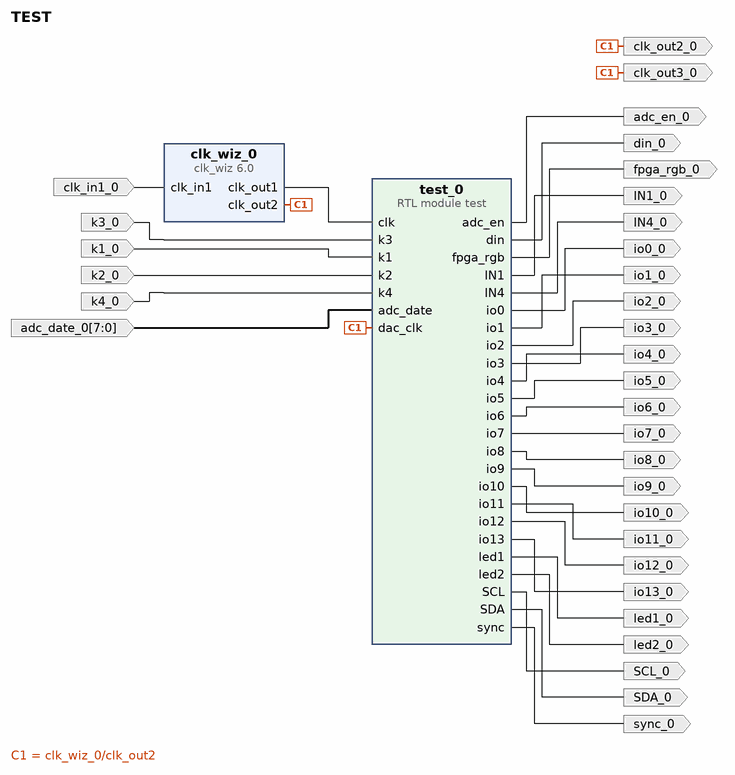
[diagram p0: block diagram of the top level]
# Vivado block design TEST, xc7s15ftgb196-1, Vivado 2018.2
create_bd_design TEST

create_bd_port -dir I k3_0
create_bd_port -dir I k1_0
create_bd_port -dir I k2_0
create_bd_port -dir I k4_0
create_bd_port -dir O io1_0
create_bd_port -dir O io2_0
create_bd_port -dir O io0_0
create_bd_port -dir O io3_0
create_bd_port -dir O io6_0
create_bd_port -dir O io4_0
create_bd_port -dir O io5_0
create_bd_port -dir O io7_0
create_bd_port -dir O io10_0
create_bd_port -dir O io8_0
create_bd_port -dir O io9_0
create_bd_port -dir O io11_0
create_bd_port -dir O led1_0
create_bd_port -dir O io12_0
create_bd_port -dir O io13_0
create_bd_port -dir O led2_0
create_bd_port -dir O fpga_rgb_0
create_bd_port -dir I -type clk clk_in1_0
create_bd_port -dir O -type clk clk_out2_0
set_property -dict {CONFIG.FREQ_HZ 20000000} [get_bd_ports clk_out2_0]
create_bd_port -dir O -type clk clk_out3_0
set_property -dict {CONFIG.FREQ_HZ 20000000} [get_bd_ports clk_out3_0]
create_bd_port -dir I -from 7 -to 0 adc_date_0
create_bd_port -dir O adc_en_0
create_bd_port -dir O din_0
create_bd_port -dir O sync_0
create_bd_port -dir O IN1_0
create_bd_port -dir O IN4_0
create_bd_port -dir O SDA_0
create_bd_port -dir O SCL_0

create_bd_cell -type ip -vlnv xilinx.com:ip:clk_wiz:6.0 clk_wiz_0
set_property -dict [list \
  CONFIG.CLKOUT2_USED true \
  CONFIG.CLKOUT3_USED false \
  CONFIG.NUM_OUT_CLKS 2 \
  CONFIG.CLKOUT1_REQUESTED_OUT_FREQ 10.000 \
  CONFIG.CLKOUT2_REQUESTED_OUT_FREQ 20.000 \
  CONFIG.CLKOUT3_REQUESTED_OUT_FREQ 20.000 \
  CONFIG.USE_LOCKED false \
  CONFIG.USE_RESET false \
  CONFIG.MMCM_DIVCLK_DIVIDE 1 \
  CONFIG.MMCM_CLKFBOUT_MULT_F 10.000 \
  CONFIG.MMCM_CLKOUT0_DIVIDE_F 100.000 \
  CONFIG.MMCM_CLKOUT1_DIVIDE 50 \
  CONFIG.MMCM_CLKOUT2_DIVIDE 1 \
  CONFIG.CLKOUT1_JITTER 209.588 \
  CONFIG.CLKOUT1_PHASE_ERROR 98.575 \
  CONFIG.CLKOUT2_JITTER 183.243 \
  CONFIG.CLKOUT2_PHASE_ERROR 98.575 \
  CONFIG.CLKOUT3_JITTER 183.243 \
  CONFIG.CLKOUT3_PHASE_ERROR 98.575 \
] [get_bd_cells clk_wiz_0]
create_bd_cell -type module -reference test test_0

# ---- connections ----

connect_bd_net -net k3_0_1 [get_bd_ports k3_0] [get_bd_pins test_0/k3]
connect_bd_net -net k1_0_1 [get_bd_ports k1_0] [get_bd_pins test_0/k1]
connect_bd_net -net k2_0_1 [get_bd_ports k2_0] [get_bd_pins test_0/k2]
connect_bd_net -net k4_0_1 [get_bd_ports k4_0] [get_bd_pins test_0/k4]
connect_bd_net [get_bd_pins test_0/io1] [get_bd_ports io1_0]
connect_bd_net [get_bd_pins test_0/io2] [get_bd_ports io2_0]
connect_bd_net [get_bd_pins test_0/io0] [get_bd_ports io0_0]
connect_bd_net [get_bd_pins test_0/io3] [get_bd_ports io3_0]
connect_bd_net [get_bd_pins test_0/io6] [get_bd_ports io6_0]
connect_bd_net [get_bd_pins test_0/io4] [get_bd_ports io4_0]
connect_bd_net [get_bd_pins test_0/io5] [get_bd_ports io5_0]
connect_bd_net [get_bd_pins test_0/io7] [get_bd_ports io7_0]
connect_bd_net [get_bd_pins test_0/io10] [get_bd_ports io10_0]
connect_bd_net [get_bd_pins test_0/io8] [get_bd_ports io8_0]
connect_bd_net [get_bd_pins test_0/io9] [get_bd_ports io9_0]
connect_bd_net [get_bd_pins test_0/io11] [get_bd_ports io11_0]
connect_bd_net [get_bd_pins test_0/led1] [get_bd_ports led1_0]
connect_bd_net [get_bd_pins test_0/io12] [get_bd_ports io12_0]
connect_bd_net [get_bd_pins test_0/io13] [get_bd_ports io13_0]
connect_bd_net [get_bd_pins test_0/led2] [get_bd_ports led2_0]
connect_bd_net [get_bd_pins test_0/fpga_rgb] [get_bd_ports fpga_rgb_0]
connect_bd_net [get_bd_pins clk_wiz_0/clk_out1] [get_bd_pins test_0/clk]
connect_bd_net -net clk_in1_0_1 [get_bd_ports clk_in1_0] [get_bd_pins clk_wiz_0/clk_in1]
connect_bd_net [get_bd_pins clk_wiz_0/clk_out2] [get_bd_ports clk_out2_0] [get_bd_ports clk_out3_0] [get_bd_pins test_0/dac_clk]
connect_bd_net -net adc_date_0_1 [get_bd_ports adc_date_0] [get_bd_pins test_0/adc_date]
connect_bd_net [get_bd_pins test_0/adc_en] [get_bd_ports adc_en_0]
connect_bd_net [get_bd_pins test_0/din] [get_bd_ports din_0]
connect_bd_net [get_bd_pins test_0/sync] [get_bd_ports sync_0]
connect_bd_net [get_bd_pins test_0/IN1] [get_bd_ports IN1_0]
connect_bd_net [get_bd_pins test_0/IN4] [get_bd_ports IN4_0]
connect_bd_net [get_bd_pins test_0/SDA] [get_bd_ports SDA_0]
connect_bd_net [get_bd_pins test_0/SCL] [get_bd_ports SCL_0]

validate_bd_design
save_bd_design
